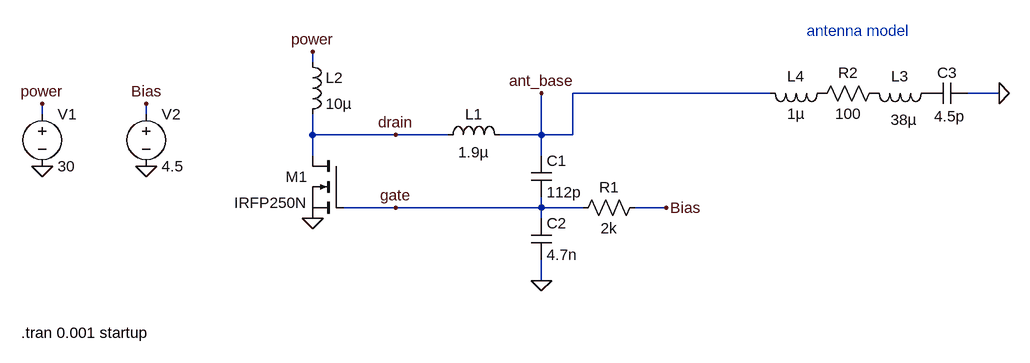
[diagram p0: schematic Mhz10-Plasma_flame.asc]
Mhz10-Plasma_flame.asc, the LTspice schematic file:
Version 4
SHEET 1 1316 680
WIRE 240 -96 240 -112
WIRE 944 -48 640 -48
WIRE 1296 -48 1248 -48
WIRE -176 -16 -176 -32
WIRE -16 -16 -16 -32
WIRE 240 16 240 -16
WIRE 368 16 240 16
WIRE 448 16 368 16
WIRE 592 16 592 -48
WIRE 592 16 528 16
WIRE 640 16 640 -48
WIRE 640 16 592 16
WIRE 240 48 240 16
WIRE 592 48 592 16
WIRE 368 128 288 128
WIRE 592 128 592 112
WIRE 592 128 368 128
WIRE 656 128 592 128
WIRE 784 128 736 128
WIRE 592 144 592 128
WIRE 592 240 592 208
FLAG -176 -32 power
FLAG 240 -112 power
FLAG 240 144 0
FLAG 592 240 0
FLAG -176 64 0
FLAG -16 -32 Bias
FLAG -16 64 0
FLAG 784 128 Bias
FLAG 1296 -48 0
FLAG 592 -48 ant_base
FLAG 368 128 gate
FLAG 368 16 drain
SYMBOL nmos 288 48 M0
SYMATTR InstName M1
SYMATTR Value IRFP250N
SYMBOL ind 432 32 R270
WINDOW 0 32 56 VTop 2
WINDOW 3 5 56 VBottom 2
SYMATTR InstName L1
SYMATTR Value 1.9µ
SYMBOL cap 576 48 R0
SYMATTR InstName C1
SYMATTR Value 112p
SYMATTR SpiceLine Rser=.01
SYMBOL voltage -176 -32 R0
WINDOW 123 0 0 Left 0
WINDOW 39 0 0 Left 0
SYMATTR InstName V1
SYMATTR Value 30
SYMBOL voltage -16 -32 R0
WINDOW 123 0 0 Left 0
WINDOW 39 0 0 Left 0
SYMATTR InstName V2
SYMATTR Value 4.5
SYMBOL cap 576 144 R0
SYMATTR InstName C2
SYMATTR Value 4.7n
SYMATTR SpiceLine Rser=.01
SYMBOL ind 224 -112 R0
SYMATTR InstName L2
SYMATTR Value 10µ
SYMBOL res 752 112 R90
WINDOW 0 0 56 VBottom 2
WINDOW 3 32 56 VTop 2
SYMATTR InstName R1
SYMATTR Value 2k
SYMBOL cap 1248 -64 R90
WINDOW 0 0 32 VBottom 2
WINDOW 3 36 28 VTop 2
SYMATTR InstName C3
SYMATTR Value 4.5p
SYMBOL ind 1200 -64 R90
WINDOW 0 5 56 VBottom 2
WINDOW 3 41 50 VTop 2
SYMATTR InstName L3
SYMATTR Value 38µ
SYMBOL res 1120 -64 R90
WINDOW 0 0 56 VBottom 2
WINDOW 3 32 56 VTop 2
SYMATTR InstName R2
SYMATTR Value 100
SYMBOL ind 1040 -64 R90
WINDOW 0 5 56 VBottom 2
WINDOW 3 32 56 VTop 2
SYMATTR InstName L4
SYMATTR Value 1µ
TEXT -208 320 Left 2 !.tran 0.001 startup
TEXT 1000 -144 Left 2 ;antenna model

The netlist it stands for:
* Mhz10-Plasma_flame.asc
M1 drain gate 0 0 IRFP250N
L1 drain ant_base 1.9µ
C1 ant_base gate 112p Rser=.01
V1 power 0 30
V2 Bias 0 4.5
C2 gate 0 4.7n Rser=.01
L2 power drain 10µ
R1 Bias gate 2k
C3 0 P001 4.5p
L3 P001 P002 38µ
R2 P002 P003 100
L4 P003 ant_base 1µ
.model NMOS NMOS
.model PMOS PMOS
.lib standard.mos
.tran 0.001 startup
* antenna model
.backanno
.end